# EAGLE design valentines-heart-r1-rotated (EAGLE 5.12)
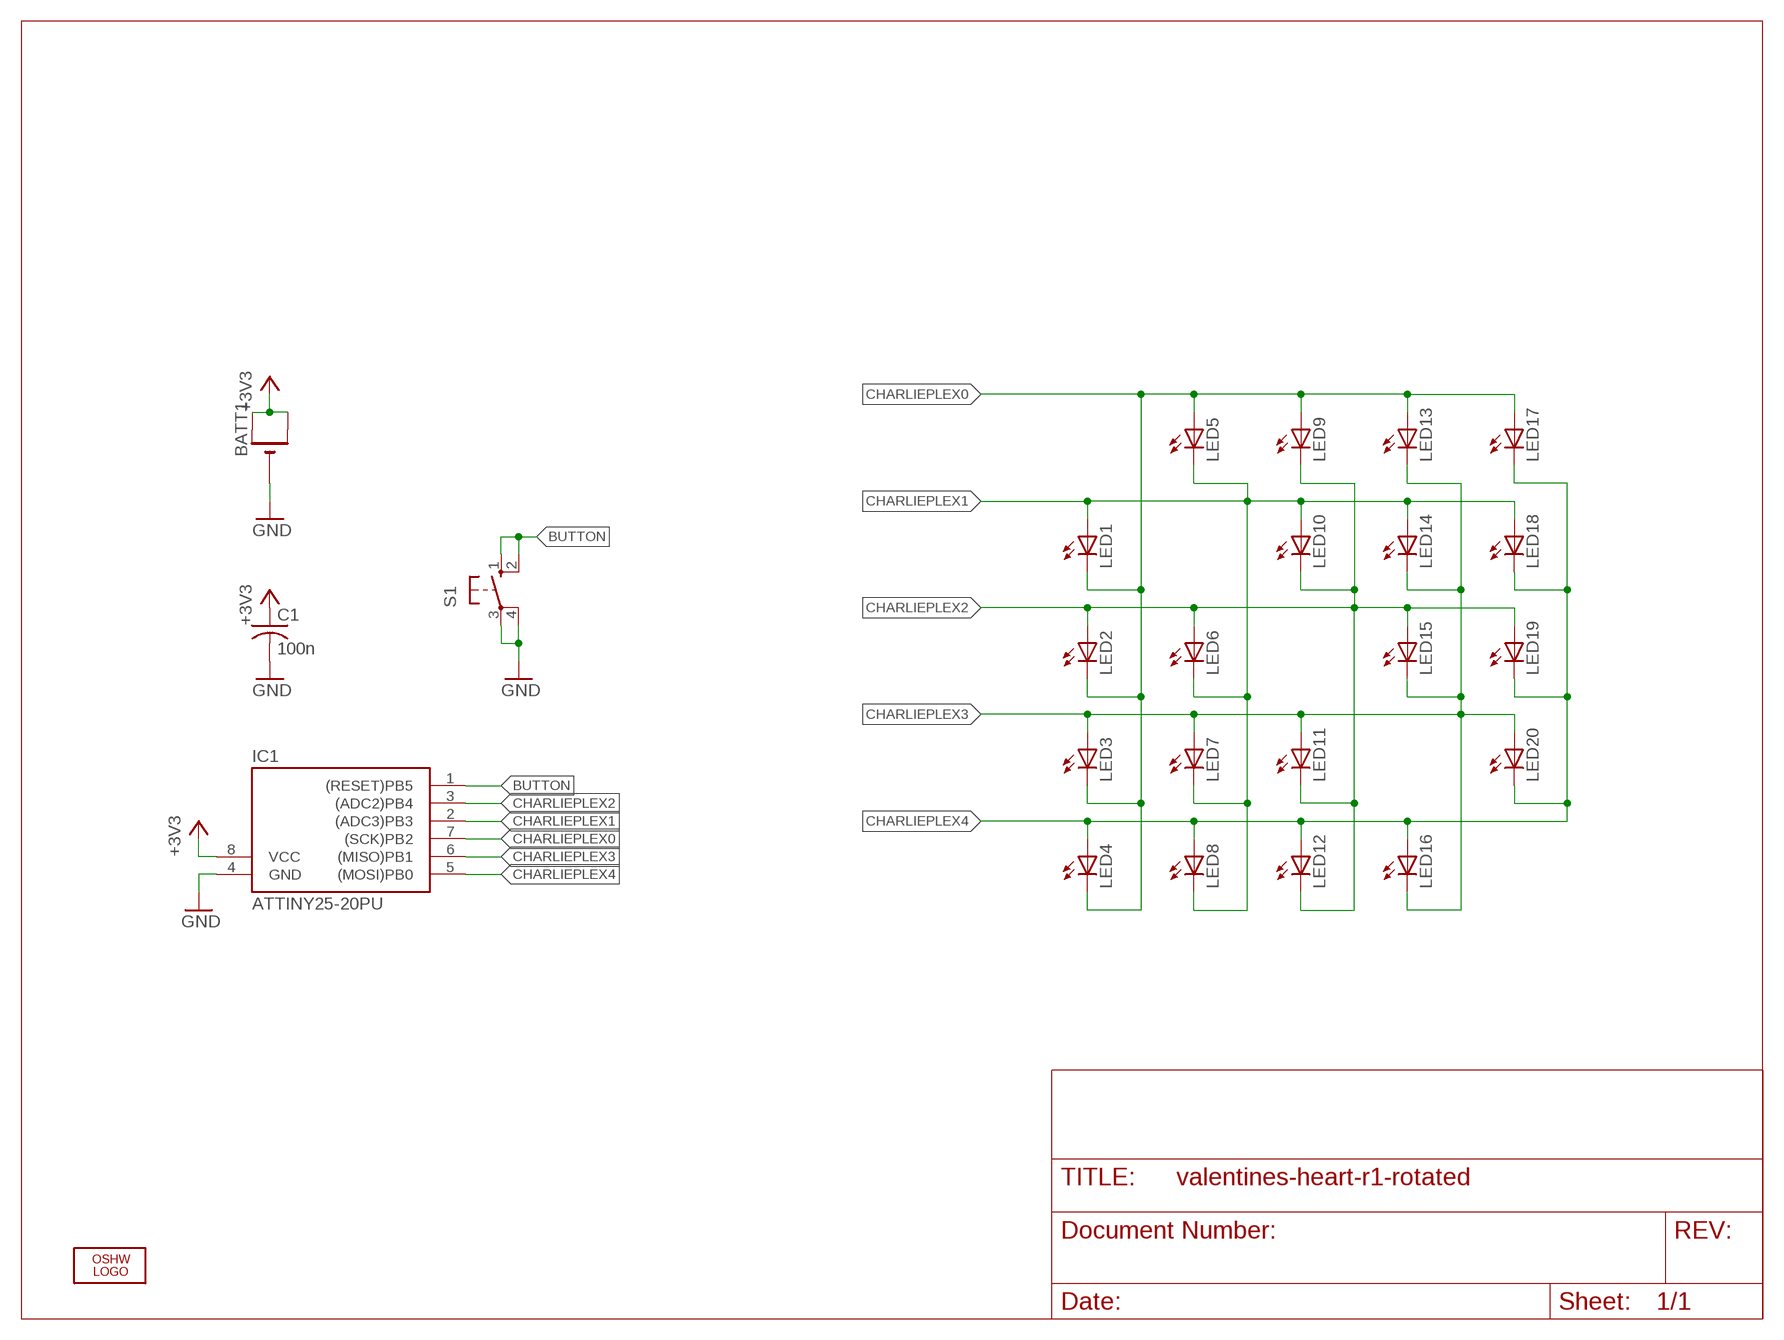
[diagram p0: schematic, sheet 1]

## Parts
BATT1  CR2032THM  [CR2032-THRU]
C1  100n  C-US050-025X075  [C050-025X075]
IC1  ATTINY25-20PU  TINY138P3  [DIL08]
LED1  LED3MM  [LED3MM]
LED2  LED3MM  [LED3MM]
LED3  LED3MM  [LED3MM]
LED4  LED3MM  [LED3MM]
LED5  LED3MM  [LED3MM]
LED6  LED3MM  [LED3MM]
LED7  LED3MM  [LED3MM]
LED8  LED3MM  [LED3MM]
LED9  LED3MM  [LED3MM]
LED10  LED3MM  [LED3MM]
LED11  LED3MM  [LED3MM]
LED12  LED3MM  [LED3MM]
LED13  LED3MM  [LED3MM]
LED14  LED3MM  [LED3MM]
LED15  LED3MM  [LED3MM]
LED16  LED3MM  [LED3MM]
LED17  LED3MM  [LED3MM]
LED18  LED3MM  [LED3MM]
LED19  LED3MM  [LED3MM]
LED20  LED3MM  [LED3MM]
LOGO1  OSHW_LOGO_FILLX0100-NT  [OSHW_FILLX100_NOTEXT]
S1  10-XX  [B3F-10XX]

## Nets
+3V3: BATT1.+1(+) BATT1.+2(+1) C1.1 IC1.8(VCC)
BUTTON: IC1.1((RESET)PB5) S1.1(S) S1.2(S1)
CHARLIEPLEX0: IC1.7((SCK)PB2) LED1.K(C) LED2.K(C) LED3.K(C) LED4.K(C) LED5.A LED9.A LED13.A LED17.A
CHARLIEPLEX1: IC1.2((ADC3)PB3) LED1.A LED5.K(C) LED6.K(C) LED7.K(C) LED8.K(C) LED10.A LED14.A LED18.A
CHARLIEPLEX2: IC1.3((ADC2)PB4) LED2.A LED6.A LED9.K(C) LED10.K(C) LED11.K(C) LED12.K(C) LED15.A LED19.A
CHARLIEPLEX3: IC1.6((MISO)PB1) LED3.A LED7.A LED11.A LED13.K(C) LED14.K(C) LED15.K(C) LED16.K(C) LED20.A
CHARLIEPLEX4: IC1.5((MOSI)PB0) LED4.A LED8.A LED12.A LED16.A LED17.K(C) LED18.K(C) LED19.K(C) LED20.K(C)
GND: BATT1.- C1.2 IC1.4(GND) S1.3(P) S1.4(P1)

## Library data of the parts
BATT1 = adafruit:CR2032
C1 = rcl:C-US: CAPACITOR, American symbol
IC1 = avr-5:TINY13*
LED1-LED20 = led:LED: LED OSRAM: - CHIPLED LG R971, LG N971, LY N971, LG Q971, LY Q971, LO R971, LY R971 LH N974, LH R974 LS Q976, LO Q976, LY Q976 LO Q996 - Hyper CHIPLED LW Q18S LB Q993, LB Q99A, LB R99A - SideLED LS A670, LO A670, LY A670, LG A670, LP A670 LB A673, LV A673, LT A673, LW A673 LH A674 LY A675 LS A676, LA A676, LO A676, LY A676, LW A676 LS A679, LY A679, LG A679 - Hyper Micro SIDELED® LS Y876, LA Y876, LO Y876, LY Y876 LT Y87S - SmartLED LW L88C, LW L88S LB L89C, LB L89S, LG L890 LS L89K, LO L89K, LY L89K LS L896, LA L896, LO L896, LY L896 - TOPLED LS T670, LO T670, LY T670, LG T670, LP T670 LSG T670, LSP T670, LSY T670, LOP T670, LYG T670 LG T671, LOG T671, LSG T671 LB T673, LV T673, LT T673, LW T673 LH T674 LS T676, LA T676, LO T676, LY T676, LB T676, LH T676, LSB T676, LW T676 LB T67C, LV T67C, LT T67C, LS T67K, LO T67K, LY T67K, LW E67C LS E67B, LA E67B, LO E67B, LY E67B, LB E67C, LV E67C, LT E67C LW T67C LS T679, LY T679, LG T679 LS T770, LO T770, LY T770, LG T770, LP T770 LB T773, LV T773, LT T773, LW T773 LH T774 LS E675, LA E675, LY E675, LS T675 LS T776, LA T776, LO T776, LY T776, LB T776 LHGB T686 LT T68C, LB T68C - Hyper Mini TOPLED® LB M676 - Mini TOPLED Santana® LG M470 LS M47K, LO M47K, LY M47K Source: http://www.osram.convergy.de LUXEON: - LUMILED® LXK2-PW12-R00, LXK2-PW12-S00, LXK2-PW14-U00, LXK2-PW14-V00 LXK2-PM12-R00, LXK2-PM12-S00, LXK2-PM14-U00 LXK2-PE12-Q00, LXK2-PE12-R00, LXK2-PE12-S00, LXK2-PE14-T00, LXK2-PE14-U00 LXK2-PB12-K00, LXK2-PB12-L00, LXK2-PB12-M00, LXK2-PB14-N00, LXK2-PB14-P00, LXK2-PB14-Q00 LXK2-PR12-L00, LXK2-PR12-M00, LXK2-PR14-Q00, LXK2-PR14-R00 LXK2-PD12-Q00, LXK2-PD12-R00, LXK2-PD12-S00 LXK2-PH12-R00, LXK2-PH12-S00 LXK2-PL12-P00, LXK2-PL12-Q00, LXK2-PL12-R00 Source: www.luxeon.com KINGBRIGHT: KA-3528ASYC Source: www.kingbright.com
LOGO1 = ohw-logo:OSHW_LOGO_FILL
S1 = rbg-generic-tact-switch:10-XX: OMRON SWITCH

## Board
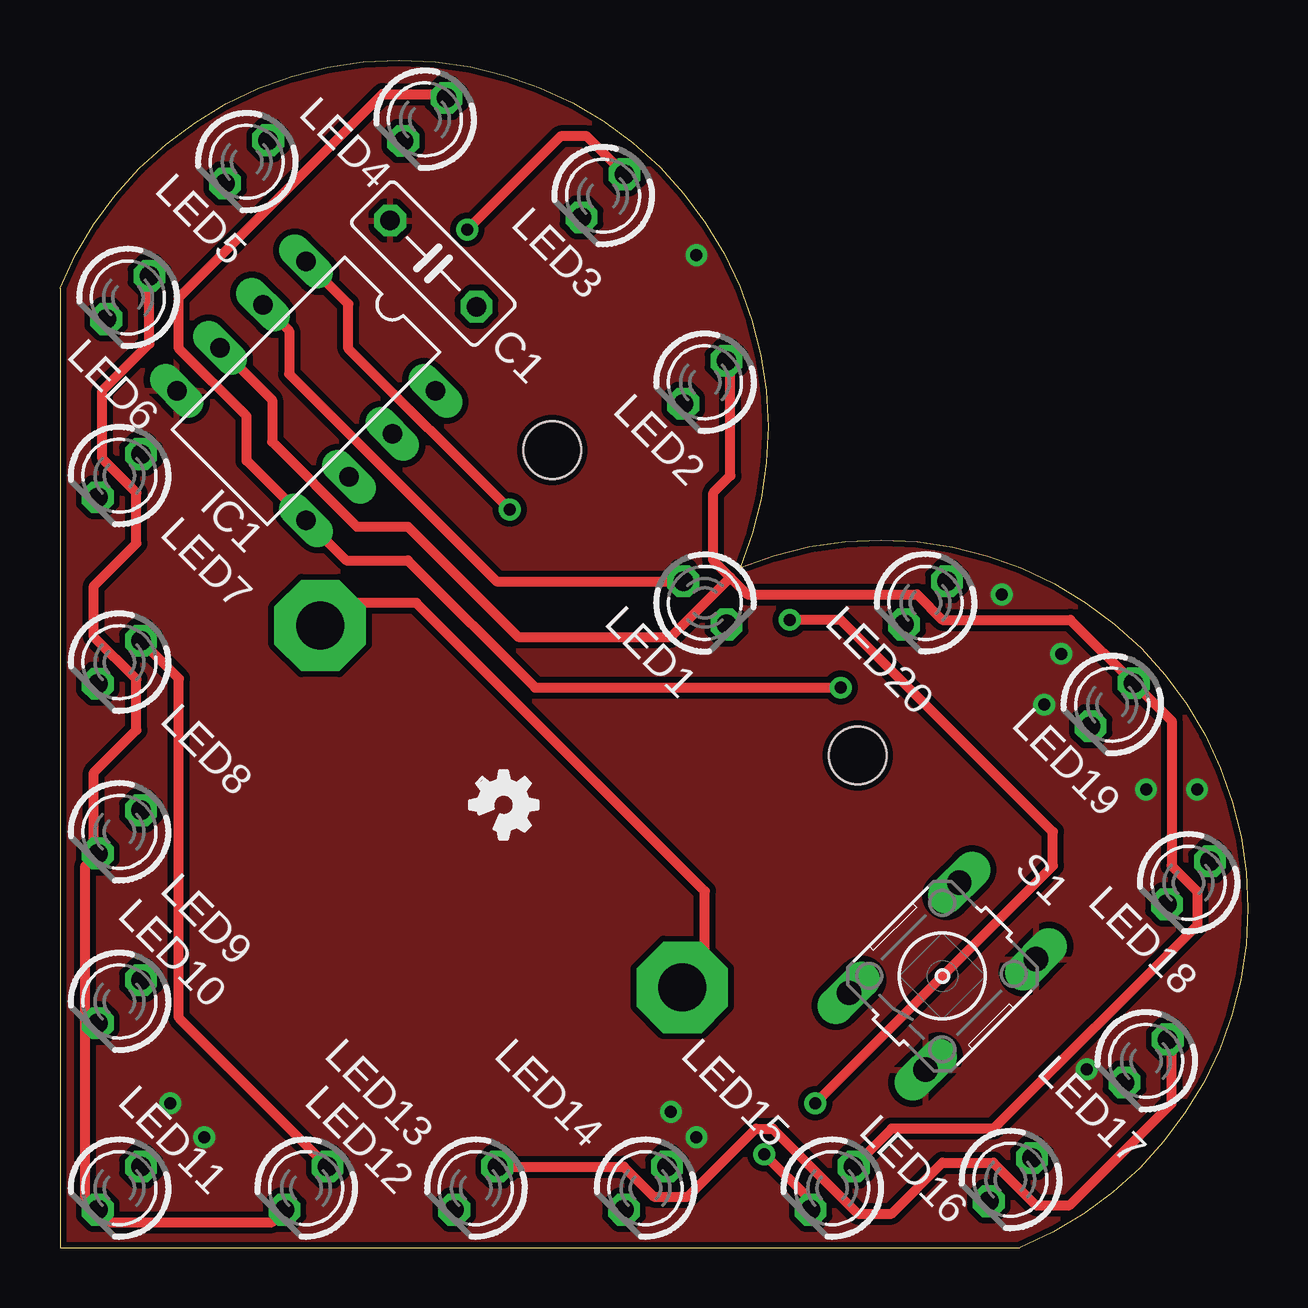
[diagram p1: board, top side]
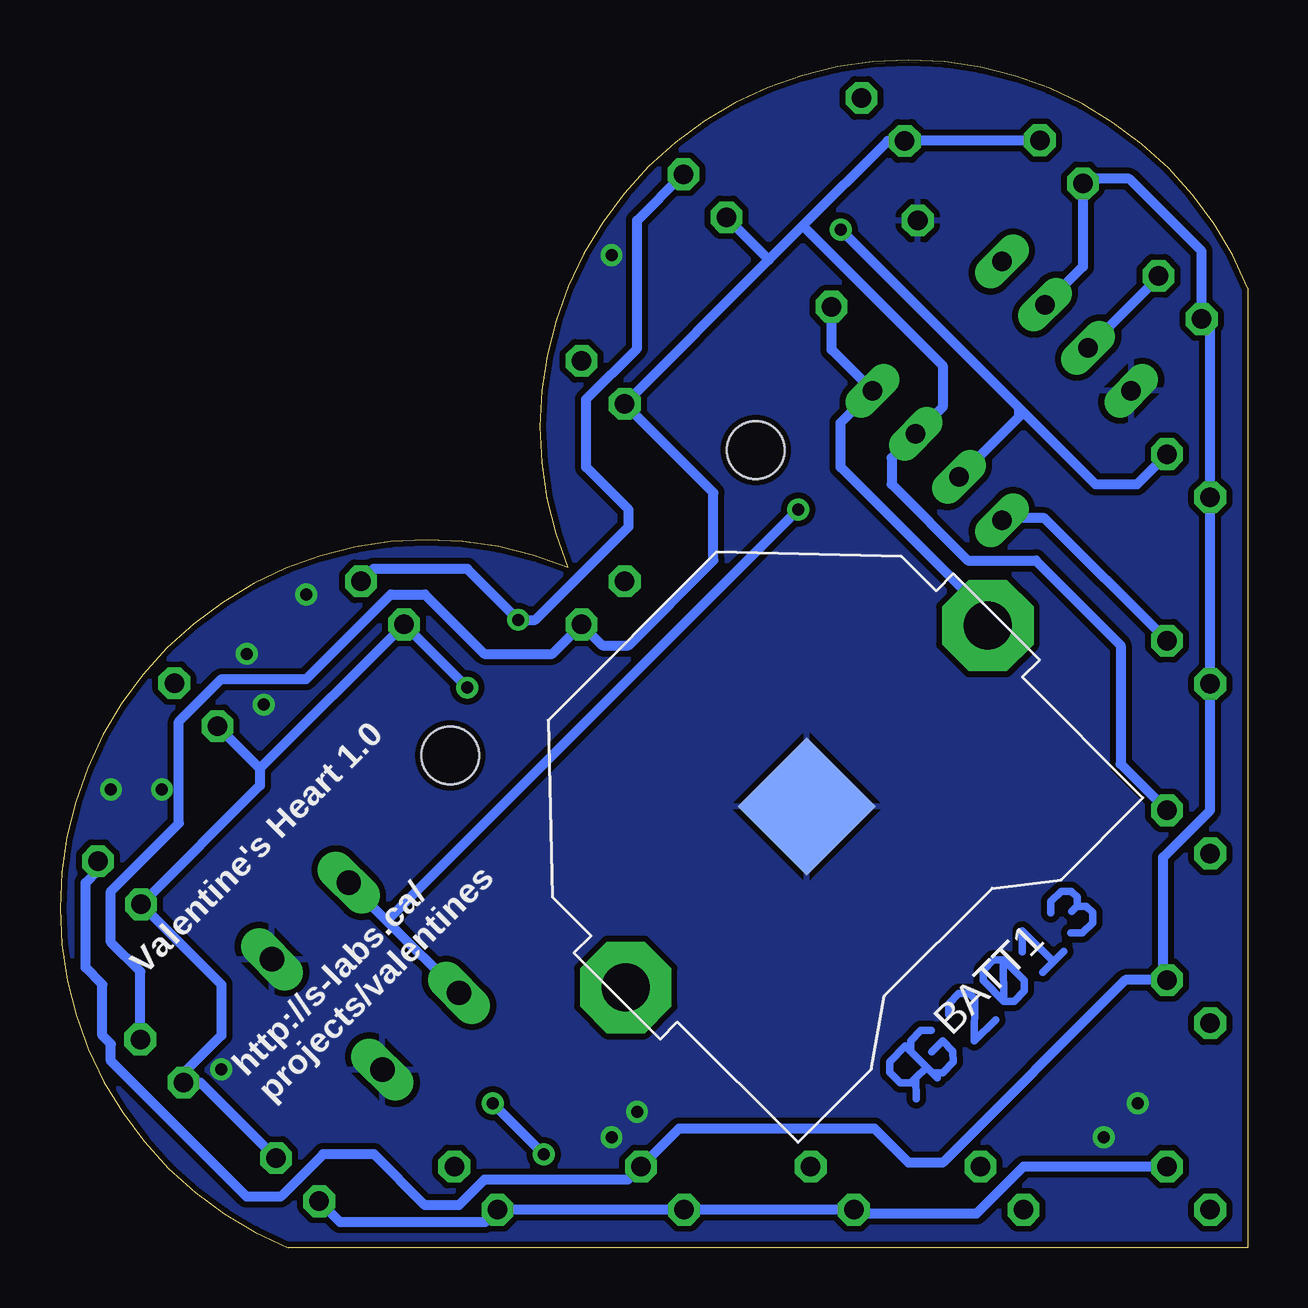
[diagram p2: board, bottom side, seen from below]

Size 49.5 x 49.5 mm. Coordinates in mm from the lower left corner, seen from the top.
Outline: 0,0 40,0 arc180 28.35,28.35 arc180 0,40 0,0
Copper layers (1*16): Top 0.035mm / dielectric 1.5mm / Bottom 0.035mm
Design rules "default *": minimum track width 10mil, minimum drill 0.5mm, track to track 8mil, track to pad 8mil, pad to pad 8mil, via to via 8mil, smd to smd 8mil, copper to edge 10mil, drill to drill 8mil, minimum pad ring 10mil, minimum via ring 8mil, stop-mask expansion 4mil, vias tented up to drill 0mil, thermal gap 10mil
Holes 2.4 mm at 20.51,33.23 33.23,20.51

### Footprints (pad centres in the part's own frame; a part is rotated, then mirrored left to right if it is on the bottom)
CR2032-THRU = drill 2 pad 3.81 octagon: +1 -10.668,0; +2 10.668,0 | smd 4.064 x 4.064: - 0,0
C050-025X075 = drill 0.813 octagon: 1 -2.54,0; 2 2.54,0
DIL08 = drill 0.813 long: 1 -3.81,-3.81; 2 -1.27,-3.81; 3 1.27,-3.81; 4 3.81,-3.81; 5 3.81,3.81; 6 1.27,3.81; 7 -1.27,3.81; 8 -3.81,3.81
LED3MM = drill 0.813 octagon: A -1.27,0; K 1.27,0
B3F-10XX = drill 1.016 long: 1 -3.251,2.261; 2 3.251,2.261; 3 -3.251,-2.261; 4 3.251,-2.261

### Placement (x,y rotation side)
BATT1  18.38,18.38 225 bottom
C1  15.56,41.01 135 top
IC1  10.25,35.71 225 top
LED1  26.87,26.87 315 top
LED2  26.87,36.06 225 top
LED3  22.63,43.84 225 top
LED4  15.2,47.02 225 top
LED5  7.78,45.25 225 top
LED6  2.83,39.6 225 top
LED7  2.47,32.17 225 top
LED8  2.47,24.4 225 top
LED9  2.47,17.32 225 top
LED10  2.47,10.25 225 top
LED11  2.47,2.47 225 top
LED12  10.25,2.47 225 top
LED13  17.32,2.47 225 top
LED14  24.4,2.47 225 top
LED15  32.17,2.47 225 top
LED16  39.6,2.83 225 top
LED17  45.25,7.78 225 top
LED18  47.02,15.2 225 top
LED19  43.84,22.63 225 top
LED20  36.06,26.87 225 top
LOGO1  16.69,18.67 315 top
S1  36.77,11.31 45 top
U$1  [RGLOGO_SMALL_2013]  12.73,7.07 45 bottom

### Tracks (layer width: path | path; a pad name or v marks a point on that pad's centre or on a via)
+3V3
  Top 0.406: BATT1.+2 26.87,11.78 26.87,14.85 14.85,26.87 11.78,26.87 BATT1.+1
  Bottom 0.406: C1.1 17.35,37.42 IC1.8 16.97,34.38 16.97,32.53 10.84,26.4 BATT1.+1
BUTTON  (via drill 0.5)
  Top 0.406: IC1.1 12.02,39.33 12.02,37.48 v18.74,30.76
  Bottom 0.406: S1.1 35.88,13.62 | 35.88,13.62 S1.2 | 35.88,13.62 v18.74,30.76
CHARLIEPLEX0
  Top 0.406: LED17.A 46.31,8.51 46.31,6.01 42.07,1.77 40.66,1.77 38.89,3.54 36.77,3.54 34.65,1.41 33.23,1.41 29.7,4.95 28.99,4.95 26.16,2.12 24.75,2.12 23.5,3.37 LED13.A
  Bottom 0.406: 18.55,42.59 15.01,46.12 LED4.K 14.28,46.15 LED5.A | 19.96,41.17 18.55,42.59 | 19.96,41.17 LED2.K 22.27,31.47 22.27,28.64 25.81,25.1 26.9,25.1 LED1.K 28.99,24.75 31.82,24.75 34.3,27.22 35.71,27.22 39.24,23.69 42.78,23.69 44.55,21.92 44.55,17.68 47.38,14.85 47.38,12.73 46.15,11.51 LED17.A | 19.96,41.17 LED3.K | 18.55,42.59 12.73,36.77 12.73,35.03 IC1.7 14.85,32.91 14.85,31.82 11.67,28.64 8.84,28.64 5.3,25.1 5.3,20.15 LED9.A
CHARLIEPLEX1
  Top 0.406: IC1.2 9.55,38.21 9.55,36.42 18.19,27.77 LED1.A
  Bottom 0.406: IC1.2 6.88,40.88 LED5.K 6.69,44.55 4.95,44.55 1.93,41.53 LED6.K 1.58,38.35 LED7.K LED8.K 1.58,18.22 3.54,16.26 3.54,11.31 LED10.A 5.11,11.15 12.73,3.54 14.14,3.54 15.56,4.95 23.72,4.95 LED14.A 25.84,2.83 31.82,2.83 32.88,1.77 34.3,1.77 36.42,3.89 38.54,3.89 40.3,2.12 41.72,2.12 47.38,7.78 47.38,8.48 47.73,8.84 47.73,10.96 48.44,11.67 48.44,15.2 47.92,15.72 LED18.A
CHARLIEPLEX2
  Top 0.406: LED12.K 8.84,1.06 2.09,1.06 LED11.K 1.06,2.09 1.06,9.19 | 1.06,9.19 1.06,15.91 LED9.K 1.41,16.59 1.41,19.8 3.18,21.57 3.18,23.69 1.41,25.46 1.41,27.58 3.18,29.34 3.18,31.47 1.77,32.88 1.77,35.71 3.73,37.67 LED6.A | LED10.K 1.41,9.19 1.06,9.19 | LED15.A 34.65,4.95 38.89,4.95 47.38,13.44 47.38,14.85 46.31,15.91 46.31,21.95 LED19.A 42.1,26.16 36.77,26.16 35.71,27.22 28.64,27.22 27.93,27.93 | LED2.A 27.93,36.8 27.93,32.17 27.22,31.47 27.22,28.64 27.93,27.93 | IC1.3 8.84,35.33 8.84,33.59 12.37,30.05 14.5,30.05 19.09,25.46 25.46,25.46 27.93,27.93
  Bottom 0.406: IC1.3 3.73,40.44 LED6.A
CHARLIEPLEX3  (via drill 0.5)
  Top 0.406: LED3.A 21.95,46.31 20.86,46.31 v16.97,42.43 | v30.41,26.16 32.53,26.16 41.37,17.32 41.37,15.91 v31.47,6.01 | v29.34,3.89 31.27,1.96 LED15.K
  Bottom 0.406: LED11.A 9.36,3.37 11.31,1.41 16.26,1.41 LED13.K LED14.K LED15.K 31.79,1.06 37.83,1.06 LED16.K | LED7.A 4.62,31.82 6.36,31.82 9.55,35 | v16.97,42.43 9.55,35 | IC1.6 9.55,34.62 9.55,35 | LED3.A 25.46,42.81 25.46,37.48 27.58,35.35 27.58,32.53 25.81,30.76 25.81,30.05 29.7,26.16 v30.41,26.16 32.53,28.28 36.44,28.28 LED20.A | v29.34,3.89 v31.47,6.01
CHARLIEPLEX4  (via drill 0.5)
  Top 0.406: LED4.A 15.94,48.08 13.44,48.08 4.95,39.6 4.95,37.48 7.78,34.65 7.78,32.8 IC1.5 11.94,28.64 14.5,28.64 19.8,23.33 v32.53,23.33 | LED12.A 4.95,9.57 4.95,23.72 LED8.A
  Bottom 0.406: LED16.A 43.65,6.88 LED17.K 44.36,7.26 42.78,8.84 42.78,10.96 LED18.K 41.17,19.25 41.17,19.96 | 41.17,19.96 LED20.K v32.53,23.33 | 41.17,19.96 LED19.K | IC1.5 10.34,30.41 8.48,30.41 LED8.A
GND  (via drill 0.5)
  other vias: 45.25,19.09 41.72,24.75 41.01,22.63 42.78,7.42 26.52,4.6 25.46,5.66 6.01,4.6 4.6,6.01 26.52,41.37 47.38,19.09 39.24,27.22
  pour Bottom (isolate 0.254): 14.85,57.28 57.98,14.14 18.74,-25.1 -24.4,18.03
  pour Top (isolate 0.254): 14.85,57.28 57.98,14.14 18.74,-25.1 -24.4,18.03

### Text on the board
bNames: Valentine's Heart 1.0 | http://s-labs.ca/ | projects/valentines